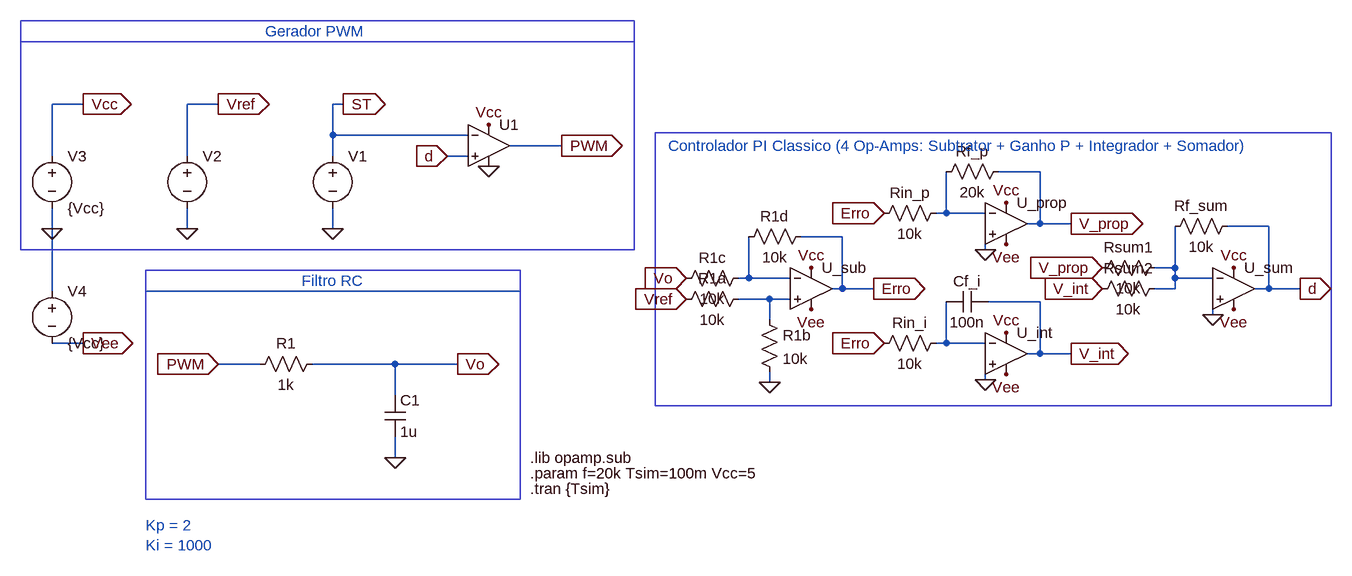
[diagram p0: schematic PI_alunos_4opamp.asc]
PI_alunos_4opamp.asc, the LTspice schematic file:
Version 4.1
SHEET 1 2332 1412
WIRE -320 16 -368 16
WIRE -112 16 -160 16
WIRE 80 16 64 16
WIRE 64 64 64 16
WIRE 272 64 64 64
WIRE 416 80 336 80
WIRE -368 96 -368 16
WIRE -160 96 -160 16
WIRE 64 96 64 64
WIRE 272 96 240 96
WIRE -368 208 -368 176
WIRE -160 208 -160 176
WIRE 64 208 64 176
WIRE 352 304 -224 304
WIRE -48 416 -112 416
WIRE 160 416 32 416
WIRE 256 416 160 416
WIRE 160 464 160 416
WIRE 160 560 160 528
WIRE -368 304 -368 208
WIRE -320 384 -368 384
FLAG 64 208 0
FLAG 80 16 ST
IOPIN 80 16 Out
FLAG 304 112 0
FLAG 240 96 d
IOPIN 240 96 In
FLAG 416 80 PWM
IOPIN 416 80 Out
FLAG -160 208 0
FLAG -112 16 Vref
IOPIN -112 16 Out
FLAG 160 560 0
FLAG -112 416 PWM
IOPIN -112 416 In
FLAG 256 416 Vo
IOPIN 256 416 Out
FLAG -368 208 0
FLAG -320 16 Vcc
IOPIN -320 16 Out
FLAG 304 48 Vcc
FLAG -320 384 Vee
IOPIN -320 384 Out
SYMBOL voltage 64 80 R0
WINDOW 3 24 96 Invisible 2
WINDOW 123 0 0 Left 0
WINDOW 39 0 0 Left 0
SYMATTR Value PULSE(0 5 0 {0.999/f} {0.001/f} 0 {1/f})
SYMATTR InstName V1
SYMBOL Opamps\\UniversalOpamp2 304 80 R0
SYMATTR InstName U1
SYMBOL voltage -160 80 R0
WINDOW 3 24 96 Invisible 2
WINDOW 123 0 0 Left 0
WINDOW 39 0 0 Left 0
SYMATTR Value PWL(0 {Vcc/4} {Tsim/4} {Vcc/4} {1.0001*Tsim/4} {Vcc/2} {Tsim/2} {Vcc/2} {1.0001*Tsim/2} 0 {3*Tsim/4} 0 {3.0001*Tsim/4} {3*Vcc/4})
SYMATTR InstName V2
SYMBOL cap 144 464 R0
SYMATTR InstName C1
SYMATTR Value 1u
SYMBOL res 48 400 R90
WINDOW 0 0 56 VBottom 2
WINDOW 3 32 56 VTop 2
SYMATTR InstName R1
SYMATTR Value 1k
SYMBOL voltage -368 80 R0
WINDOW 123 0 0 Left 0
WINDOW 39 0 0 Left 0
SYMATTR InstName V3
SYMATTR Value {Vcc}
SYMBOL voltage -368 288 R0
WINDOW 123 0 0 Left 0
WINDOW 39 0 0 Left 0
SYMATTR InstName V4
SYMATTR Value {Vcc}
TEXT 368 608 Left 2 !.tran {Tsim}
TEXT 368 584 Left 2 !.param f=20k Tsim=100m Vcc=5
TEXT -40 -96 Left 2 ;Gerador PWM
TEXT 16 288 Left 2 ;Filtro RC
TEXT -224 664 Left 2 ;Kp = 2\nKi = 1000
TEXT 368 560 Left 2 !.lib opamp.sub
LINE Normal -416 -80 528 -80
RECTANGLE Normal 352 624 -224 272
RECTANGLE Normal -416 240 528 -112
FLAG 608 316 Vref
IOPIN 608 316 In
FLAG 608 284 Vo
IOPIN 608 284 In
FLAG 736 444 0
FLAG 800 268 Vcc
FLAG 800 332 Vee
FLAG 896 300 Erro
IOPIN 896 300 Out
WIRE 768 316 688 316
WIRE 736 348 736 316
WIRE 736 444 736 428
WIRE 768 284 688 284
WIRE 704 284 704 220
WIRE 848 220 784 220
WIRE 848 300 848 220
WIRE 848 300 832 300
WIRE 896 300 848 300
SYMBOL Opamps\\UniversalOpamp2 800 300 R0
SYMATTR InstName U_sub
SYMBOL res 704 300 R90
WINDOW 0 0 56 VBottom 2
WINDOW 3 32 56 VTop 2
SYMATTR InstName R1a
SYMATTR Value 10k
SYMBOL res 720 332 R0
SYMATTR InstName R1b
SYMATTR Value 10k
SYMBOL res 704 268 R90
WINDOW 0 0 56 VBottom 2
WINDOW 3 32 56 VTop 2
SYMATTR InstName R1c
SYMATTR Value 10k
SYMBOL res 800 204 R90
WINDOW 0 0 56 VBottom 2
WINDOW 3 32 56 VTop 2
SYMATTR InstName R1d
SYMATTR Value 10k
FLAG 912 184 Erro
IOPIN 912 184 In
FLAG 1068 240 0
FLAG 1100 168 Vcc
FLAG 1100 232 Vee
FLAG 1200 200 V_prop
IOPIN 1200 200 Out
WIRE 1068 184 992 184
WIRE 1068 240 1068 216
WIRE 1008 184 1008 120
WIRE 1152 120 1088 120
WIRE 1152 200 1152 120
WIRE 1152 200 1132 200
WIRE 1200 200 1152 200
SYMBOL Opamps\\UniversalOpamp2 1100 200 R0
SYMATTR InstName U_prop
SYMBOL res 1008 168 R90
WINDOW 0 0 56 VBottom 2
WINDOW 3 32 56 VTop 2
SYMATTR InstName Rin_p
SYMATTR Value 10k
SYMBOL res 1104 104 R90
WINDOW 0 0 56 VBottom 2
WINDOW 3 32 56 VTop 2
SYMATTR InstName Rf_p
SYMATTR Value 20k
FLAG 912 384 Erro
IOPIN 912 384 In
FLAG 1068 440 0
FLAG 1100 368 Vcc
FLAG 1100 432 Vee
FLAG 1200 400 V_int
IOPIN 1200 400 Out
WIRE 1068 384 992 384
WIRE 1068 440 1068 416
WIRE 1008 384 1008 320
WIRE 1152 320 1072 320
WIRE 1152 400 1152 320
WIRE 1152 400 1132 400
WIRE 1200 400 1152 400
SYMBOL Opamps\\UniversalOpamp2 1100 400 R0
SYMATTR InstName U_int
SYMBOL res 1008 368 R90
WINDOW 0 0 56 VBottom 2
WINDOW 3 32 56 VTop 2
SYMATTR InstName Rin_i
SYMATTR Value 10k
SYMBOL cap 1072 304 R90
WINDOW 0 0 32 VBottom 2
WINDOW 3 32 32 VTop 2
SYMATTR InstName Cf_i
SYMATTR Value 100n
FLAG 1248 268 V_prop
IOPIN 1248 268 In
FLAG 1248 300 V_int
IOPIN 1248 300 In
FLAG 1418 340 0
FLAG 1450 268 Vcc
FLAG 1450 332 Vee
FLAG 1552 300 d
IOPIN 1552 300 Out
WIRE 1418 340 1418 316
WIRE 1360 268 1328 268
WIRE 1360 300 1328 300
WIRE 1360 300 1360 268
WIRE 1418 284 1360 284
WIRE 1360 268 1360 204
WIRE 1504 204 1440 204
WIRE 1504 300 1504 204
WIRE 1504 300 1482 300
WIRE 1552 300 1504 300
SYMBOL Opamps\\UniversalOpamp2 1450 300 R0
SYMATTR InstName U_sum
SYMBOL res 1344 252 R90
WINDOW 0 0 56 VBottom 2
WINDOW 3 32 56 VTop 2
SYMATTR InstName Rsum1
SYMATTR Value 10k
SYMBOL res 1344 284 R90
WINDOW 0 0 56 VBottom 2
WINDOW 3 32 56 VTop 2
SYMATTR InstName Rsum2
SYMATTR Value 10k
SYMBOL res 1456 188 R90
WINDOW 0 0 56 VBottom 2
WINDOW 3 32 56 VTop 2
SYMATTR InstName Rf_sum
SYMATTR Value 10k
TEXT 580 80 Left 2 ;Controlador PI Classico (4 Op-Amps: Subtrator + Ganho P + Integrador + Somador)
RECTANGLE Normal 1600 480 560 60

The netlist it stands for:
* PI_alunos_4opamp.asc
V1 ST 0 PULSE(0 5 0 {0.999/f} {0.001/f} 0 {1/f})
X§U1 d ST Vcc 0 PWM level.2 Avol=1Meg GBW=10Meg Slew=10Meg ilimit=25m rail=0 Vos=0 phimargin=45 en=0 enk=0 in=0 ink=0 Rin=500Meg  ; pins IN+ IN- V+ V- OUT
V2 Vref 0 PWL(0 {Vcc/4} {Tsim/4} {Vcc/4} {1.0001*Tsim/4} {Vcc/2} {Tsim/2} {Vcc/2} {1.0001*Tsim/2} 0 {3*Tsim/4} 0 {3.0001*Tsim/4} {3*Vcc/4})
C1 Vo 0 1u
R1 Vo PWM 1k
V3 Vcc 0 {Vcc}
V4 0 Vee {Vcc}
X§U_sub N002 N003 Vcc Vee Erro level.2 Avol=1Meg GBW=10Meg Slew=10Meg ilimit=25m rail=0 Vos=0 phimargin=45 en=0 enk=0 in=0 ink=0 Rin=500Meg  ; pins IN+ IN- V+ V- OUT
R1a N002 Vref 10k
R1b N002 0 10k
R1c N003 Vo 10k
R1d Erro N003 10k
X§U_prop 0 N004 Vcc Vee V_prop level.2 Avol=1Meg GBW=10Meg Slew=10Meg ilimit=25m rail=0 Vos=0 phimargin=45 en=0 enk=0 in=0 ink=0 Rin=500Meg  ; pins IN+ IN- V+ V- OUT
Rin_p N004 Erro 10k
Rf_p V_prop N004 20k
X§U_int 0 N005 Vcc Vee V_int level.2 Avol=1Meg GBW=10Meg Slew=10Meg ilimit=25m rail=0 Vos=0 phimargin=45 en=0 enk=0 in=0 ink=0 Rin=500Meg  ; pins IN+ IN- V+ V- OUT
Rin_i N005 Erro 10k
Cf_i V_int N005 100n
X§U_sum 0 N006 Vcc Vee d level.2 Avol=1Meg GBW=10Meg Slew=10Meg ilimit=25m rail=0 Vos=0 phimargin=45 en=0 enk=0 in=0 ink=0 Rin=500Meg  ; pins IN+ IN- V+ V- OUT
Rsum1 N006 V_prop 10k
Rsum2 N006 V_int 10k
Rf_sum d N006 10k
.tran {Tsim}
.param f=20k Tsim=100m Vcc=5
* Gerador PWM
* Filtro RC
* Kp = 2
* Ki = 1000
.lib opamp.sub
* Controlador PI Classico (4 Op-Amps: Subtrator + Ganho P + Integrador + Somador)
.lib UniversalOpamps2.sub
.backanno
.end